# EAGLE design pc_kalam_gpio_cap (EAGLE 6.4)
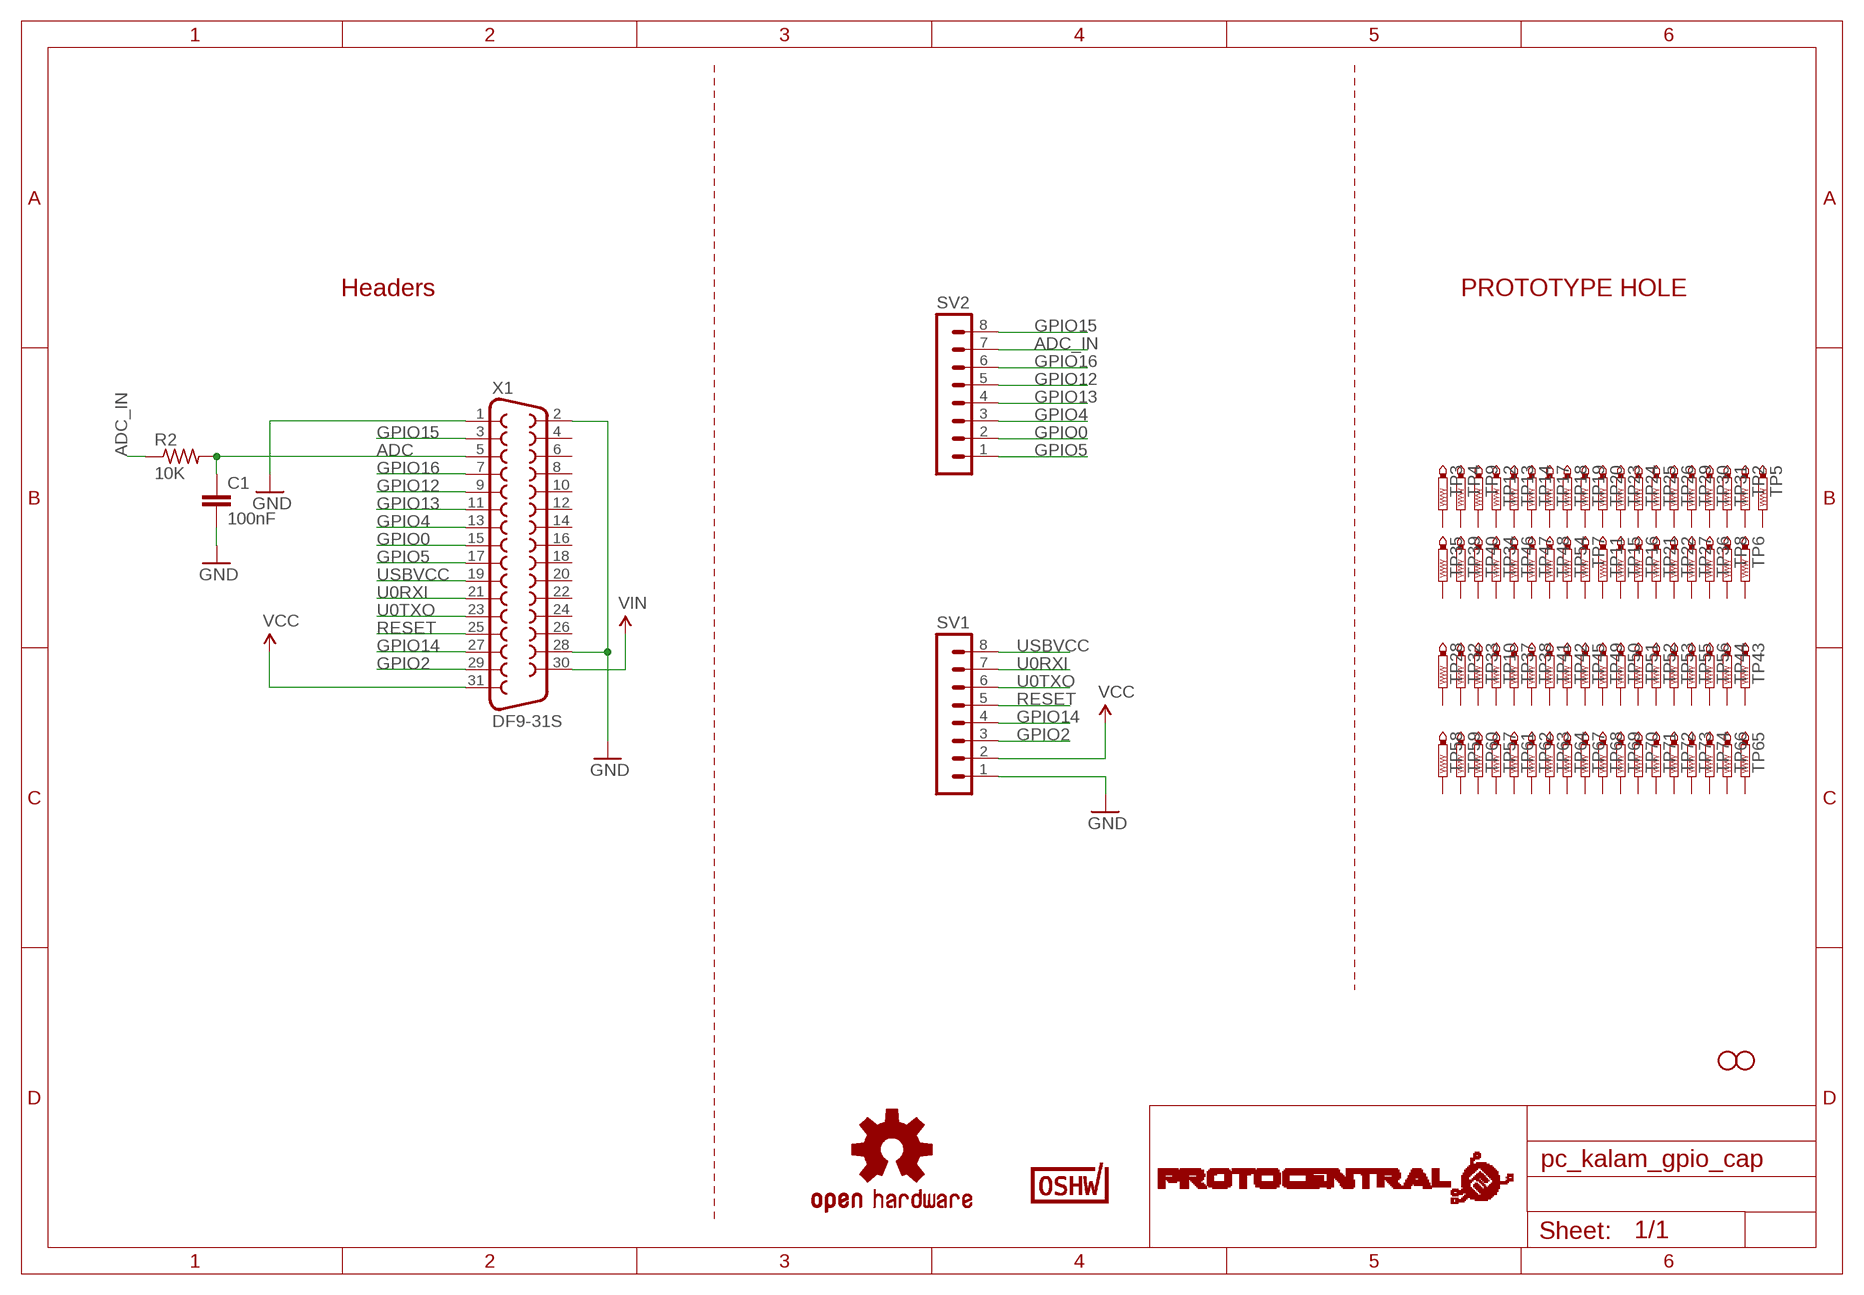
[diagram p0: schematic, sheet 1]

## Parts
C1  100nF  C-EUC0805  [C0805]
R2  10K  R-US_R0805  [R0805]
STANDOFF7  STAND-OFF  [STAND-OFF]
STANDOFF8  STAND-OFF  [STAND-OFF]
SV1  MA08-1  [MA08-1]
SV2  MA08-1  [MA08-1]
TP2  PTR1PAD1-13  [P1-13]
TP3  PTR1PAD1-13  [P1-13]
TP4  PTR1PAD1-13  [P1-13]
TP5  PTR1PAD1-13  [P1-13]
TP6  PTR1PAD1-13  [P1-13]
TP7  PTR1PAD1-13  [P1-13]
TP8  PTR1PAD1-13  [P1-13]
TP9  PTR1PAD1-13  [P1-13]
TP10  PTR1PAD1-13  [P1-13]
TP11  PTR1PAD1-13  [P1-13]
TP12  PTR1PAD1-13  [P1-13]
TP13  PTR1PAD1-13  [P1-13]
TP14  PTR1PAD1-13  [P1-13]
TP15  PTR1PAD1-13  [P1-13]
TP16  PTR1PAD1-13  [P1-13]
TP17  PTR1PAD1-13  [P1-13]
TP18  PTR1PAD1-13  [P1-13]
TP19  PTR1PAD1-13  [P1-13]
TP20  PTR1PAD1-13  [P1-13]
TP21  PTR1PAD1-13  [P1-13]
TP22  PTR1PAD1-13  [P1-13]
TP23  PTR1PAD1-13  [P1-13]
TP24  PTR1PAD1-13  [P1-13]
TP25  PTR1PAD1-13  [P1-13]
TP26  PTR1PAD1-13  [P1-13]
TP27  PTR1PAD1-13  [P1-13]
TP28  PTR1PAD1-13  [P1-13]
TP29  PTR1PAD1-13  [P1-13]
TP30  PTR1PAD1-13  [P1-13]
TP31  PTR1PAD1-13  [P1-13]
TP32  PTR1PAD1-13  [P1-13]
TP33  PTR1PAD1-13  [P1-13]
TP34  PTR1PAD1-13  [P1-13]
TP35  PTR1PAD1-13  [P1-13]
TP36  PTR1PAD1-13  [P1-13]
TP37  PTR1PAD1-13  [P1-13]
TP38  PTR1PAD1-13  [P1-13]
TP39  PTR1PAD1-13  [P1-13]
TP40  PTR1PAD1-13  [P1-13]
TP41  PTR1PAD1-13  [P1-13]
TP42  PTR1PAD1-13  [P1-13]
TP43  PTR1PAD1-13  [P1-13]
TP44  PTR1PAD1-13  [P1-13]
TP45  PTR1PAD1-13  [P1-13]
TP46  PTR1PAD1-13  [P1-13]
TP47  PTR1PAD1-13  [P1-13]
TP48  PTR1PAD1-13  [P1-13]
TP49  PTR1PAD1-13  [P1-13]
TP50  PTR1PAD1-13  [P1-13]
TP51  PTR1PAD1-13  [P1-13]
TP52  PTR1PAD1-13  [P1-13]
TP53  PTR1PAD1-13  [P1-13]
TP54  PTR1PAD1-13  [P1-13]
TP55  PTR1PAD1-13  [P1-13]
TP56  PTR1PAD1-13  [P1-13]
TP57  PTR1PAD1-13  [P1-13]
TP58  PTR1PAD1-13  [P1-13]
TP59  PTR1PAD1-13  [P1-13]
TP60  PTR1PAD1-13  [P1-13]
TP61  PTR1PAD1-13  [P1-13]
TP62  PTR1PAD1-13  [P1-13]
TP63  PTR1PAD1-13  [P1-13]
TP64  PTR1PAD1-13  [P1-13]
TP65  PTR1PAD1-13  [P1-13]
TP66  PTR1PAD1-13  [P1-13]
TP67  PTR1PAD1-13  [P1-13]
TP68  PTR1PAD1-13  [P1-13]
TP69  PTR1PAD1-13  [P1-13]
TP70  PTR1PAD1-13  [P1-13]
TP71  PTR1PAD1-13  [P1-13]
TP72  PTR1PAD1-13  [P1-13]
TP73  PTR1PAD1-13  [P1-13]
TP74  PTR1PAD1-13  [P1-13]
U$2  CERT-SMALL  [CERT-SMALL-SILK]
U$3  OSHW-LOGOS  [OSHW-LOGO-S]
U$6  PROTY_LOGO_WITH_TEXT  [PROTY_WITH_TEXT]
X1  DF9-31S  [DF9-31S]

## Nets
ADC: C1.1 R2.2 X1.5
ADC_IN: R2.1 SV2.7
GND: C1.2 SV1.1 X1.1 X1.2 X1.28
GPIO0: SV2.2 X1.15
GPIO2: SV1.3 X1.29
GPIO4: SV2.3 X1.13
GPIO5: SV2.1 X1.17
GPIO12: SV2.5 X1.9
GPIO13: SV2.4 X1.11
GPIO14: SV1.4 X1.27
GPIO15: SV2.8 X1.3
GPIO16: SV2.6 X1.7
RESET: SV1.5 X1.25
U0RXI: SV1.7 X1.21
U0TXO: SV1.6 X1.23
USBVCC: SV1.8 X1.19
VCC: SV1.2 X1.31
VIN: X1.30
Unconnected: TP2.TP TP3.TP TP4.TP TP5.TP TP6.TP TP7.TP TP8.TP TP9.TP TP10.TP TP11.TP TP12.TP TP13.TP TP14.TP TP15.TP TP16.TP TP17.TP TP18.TP TP19.TP TP20.TP TP21.TP TP22.TP TP23.TP TP24.TP TP25.TP TP26.TP TP27.TP TP28.TP TP29.TP TP30.TP TP31.TP TP32.TP TP33.TP TP34.TP TP35.TP TP36.TP TP37.TP TP38.TP TP39.TP TP40.TP TP41.TP TP42.TP TP43.TP TP44.TP TP45.TP TP46.TP TP47.TP TP48.TP TP49.TP TP50.TP TP51.TP TP52.TP TP53.TP TP54.TP TP55.TP TP56.TP TP57.TP TP58.TP TP59.TP TP60.TP TP61.TP TP62.TP TP63.TP TP64.TP TP65.TP TP66.TP TP67.TP TP68.TP TP69.TP TP70.TP TP71.TP TP72.TP TP73.TP TP74.TP X1.4 X1.6 X1.8 X1.10 X1.12 X1.14 X1.16 X1.18 X1.20 X1.22 X1.24 X1.26

## Notes on the sheet
- Headers | PROTOTYPE HOLE

## Library data of the parts
C1 = rcl:C-EU: CAPACITOR, European symbol
R2 = rcl:R-US_: RESISTOR, American symbol
STANDOFF7 STANDOFF8 = SparkFun-Electromechanical:STAND-OFF: #4 Stand Off This is the mechanical footprint for a #4 phillips button head screw. Use the keepout ring to avoid running the screw head into surrounding components. SKU : PRT-00447
SV1 SV2 = con-lstb:MA08-1: PIN HEADER; OC_FARNELL: unknown; OC_NEWARK: unknown
TP2-TP74 = testpad:PTR1: TEST PIN
U$2 = OSHWA:CERT
U$3 = SparkFun:OSHW-LOGO: Open Source Hardware Logo This logo indicates the piece of hardware it is found on incorporates a OSHW license and/or adheres to the definition of open source hardware found here: http://freedomdefined.org/OSHW
U$6 = circuitects:PROTY_LOGO_WITH_TEXT
X1 = con-hirose:DF9-31S: SMD CONNECTOR Source: con-hirose.lbr from Bob Starr <rtzaudio@mindspring.com>; MPN: DF9-31S-1V(32); OC_FARNELL: 1798382; OC_NEWARK: 74R3383

## Board
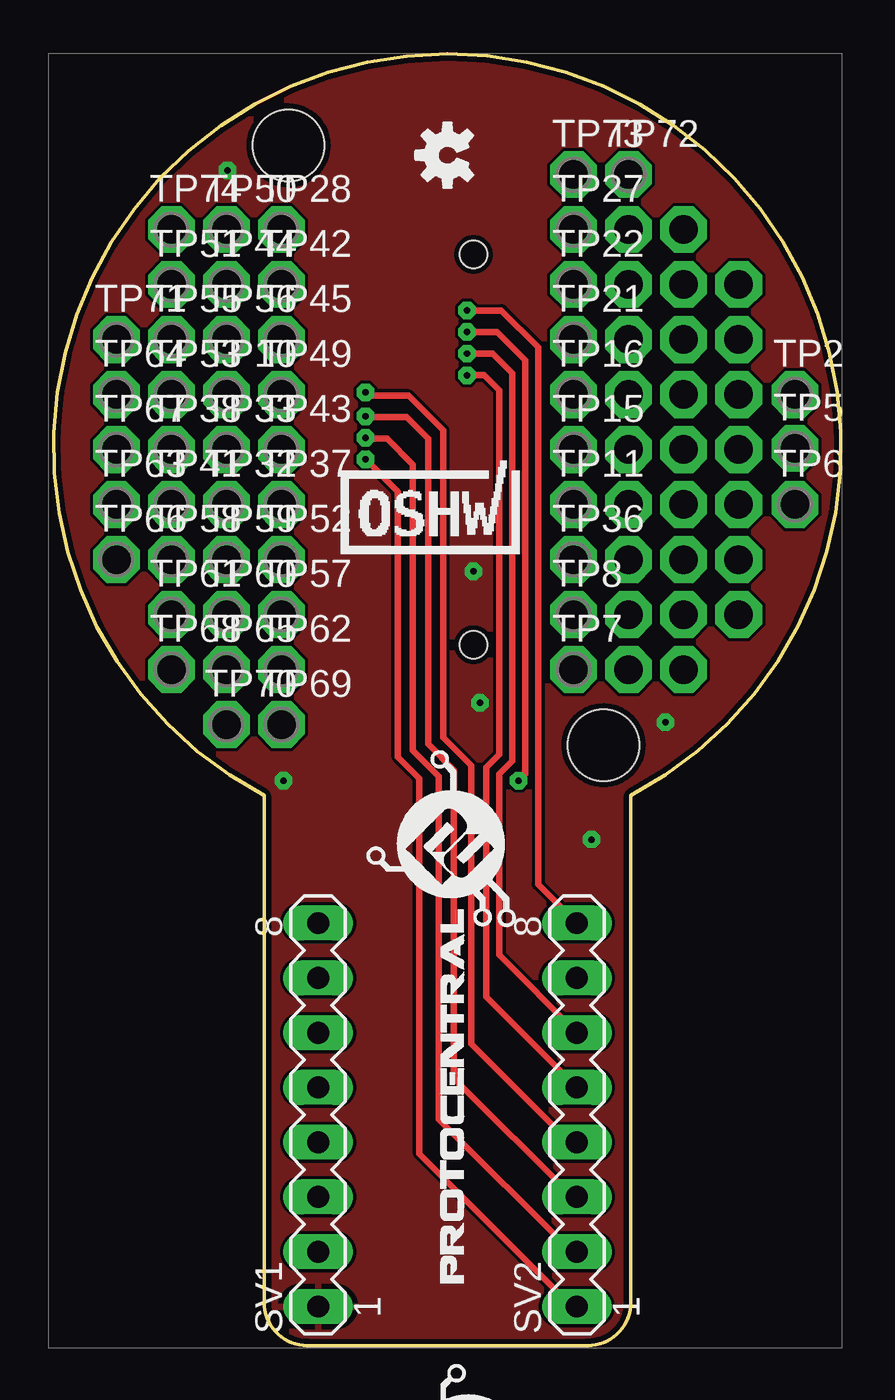
[diagram p1: board, top side]
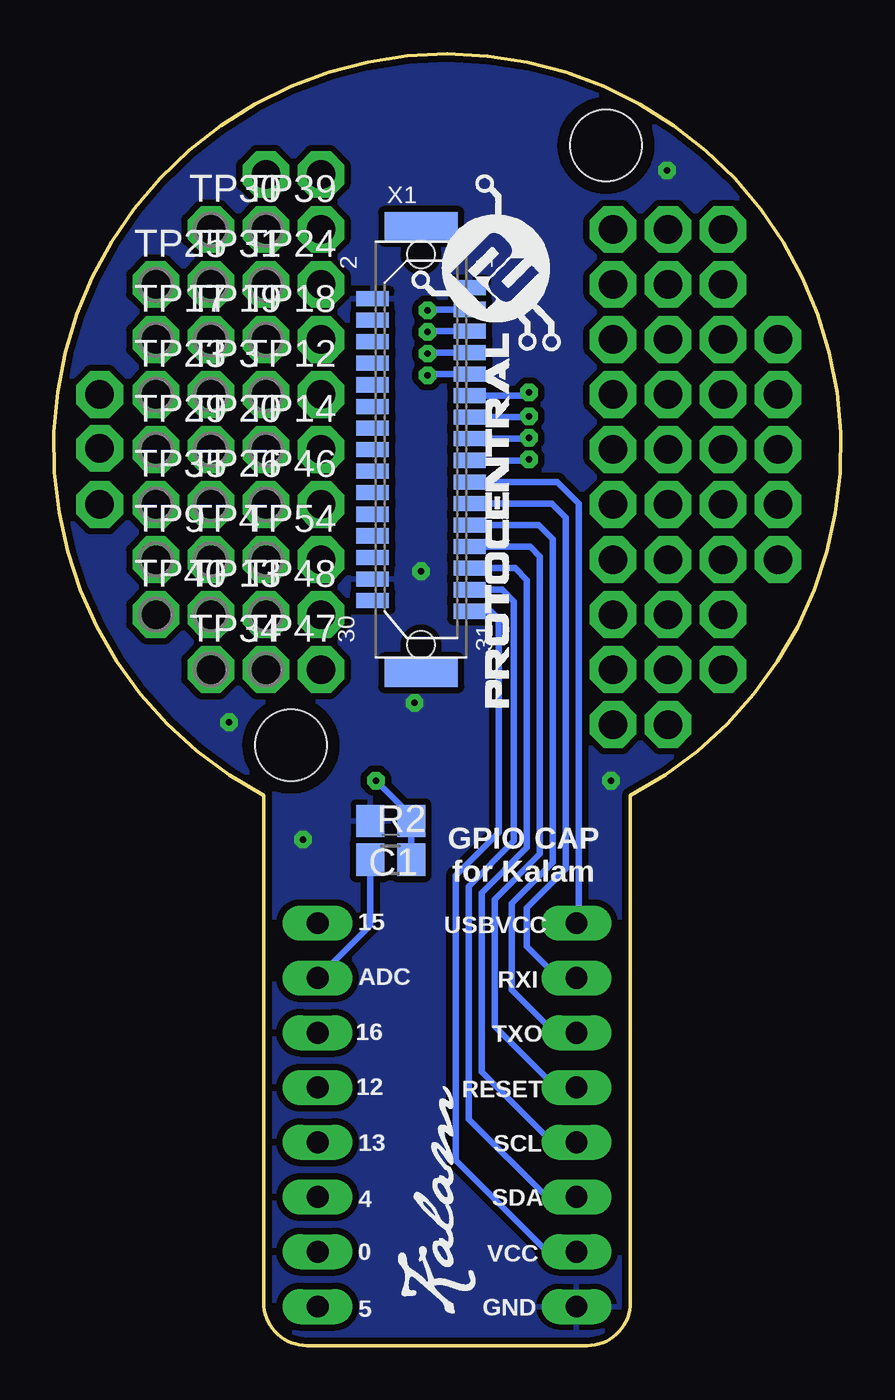
[diagram p2: board, bottom side, seen from below]

Size 36.47 x 59.9 mm. Coordinates in mm from the lower left corner, seen from the top.
Outline: 26.74,25.5 26.74,2 arc-90 24.74,0 11.74,0 arc-90 9.74,2 9.74,25.5 arc-304 26.74,25.51
Copper layers (1*2*15*16): Top 0.035mm / dielectric 1.5mm / Route2 0.035mm / dielectric 0.15mm / Route15 0.035mm / dielectric 0.2mm / Bottom 0.035mm
Design rules "Circuitects-Rules": minimum track width 6mil, minimum drill 0.3mm, track to track 6mil, track to pad 6mil, pad to pad 6mil, via to via 6mil, smd to smd 6mil, copper to edge 10mil, drill to drill 8mil, minimum pad ring 12mil, minimum via ring 10mil, stop-mask expansion 4mil, vias tented up to drill 25mil, thermal gap 10mil

### Footprints (pad centres in the part's own frame; a part is rotated, then mirrored left to right if it is on the bottom)
C0805 = smd 1.3 x 1.5: 1 -0.95,0; 2 0.95,0
R0805 = smd 1.3 x 1.5: 1 -0.95,0; 2 0.95,0
STAND-OFF = hole 3.302: 0,0
MA08-1 = drill 1.016 long: 1 -8.89,0; 2 -6.35,0; 3 -3.81,0; 4 -1.27,0; 5 1.27,0; 6 3.81,0; 7 6.35,0; 8 8.89,0
P1-13 = drill 1.321 pad 2.159 octagon: TP 0,0
DF9-31S = smd 0.7 x 1.5: 1 -7.5,2.25; 2 -7,-2.25; 3 -6.5,2.25; 4 -6,-2.25; 5 -5.5,2.25; 6 -5,-2.25; 7 -4.5,2.25; 8 -4,-2.25; 9 -3.5,2.25; 10 -3,-2.25; 11 -2.5,2.25; 12 -2,-2.25; 13 -1.5,2.25; 14 -1,-2.25; 15 -0.5,2.25; 16 0,-2.25; 17 0.5,2.25; 18 1,-2.25; 19 1.5,2.25; 20 2,-2.25; 21 2.5,2.25; 22 3,-2.25; 23 3.5,2.25; 24 4,-2.25; 25 4.5,2.25; 26 5,-2.25; 27 5.5,2.25; 28 6,-2.25; 29 6.5,2.25; 30 7,-2.25; 31 7.5,2.25 | smd 1.3 x 3.4: M1 -10.35,0; M2 10.35,0 | hole 1.27: 9.05,0; -9.05,0

### Placement (x,y rotation side)
C1  20.86,24.33 180 bottom
R2  20.86,22.53 0 bottom
STANDOFF7  10.88,55.66 0 bottom
STANDOFF8  25.48,27.84 0 bottom
SV1  12.24,10.7 90 top
SV2  24.24,10.7 90 top
TP2  34.34,44.1 0 top
TP3  29.19,44.1 0 bottom
TP4  29.19,36.45 0 bottom
TP5  34.34,41.6 0 top
TP6  34.34,39 0 top
TP7  24.09,31.35 0 top
TP8  24.09,33.9 0 top
TP9  31.74,36.45 0 bottom
TP10  7.99,44.1 0 top
TP11  24.09,39 0 top
TP12  26.64,44.1 0 bottom
TP13  29.19,33.9 0 bottom
TP14  26.64,41.55 0 bottom
TP15  24.09,41.55 0 top
TP16  24.09,44.1 0 top
TP17  31.74,46.65 0 bottom
TP18  26.64,46.65 0 bottom
TP19  29.19,46.65 0 bottom
TP20  29.19,41.55 0 bottom
TP21  24.09,46.65 0 top
TP22  24.09,49.2 0 top
TP23  31.74,44.1 0 bottom
TP24  26.64,49.2 0 bottom
TP25  31.74,49.2 0 bottom
TP26  29.19,39 0 bottom
TP27  24.09,51.75 0 top
TP28  10.54,51.75 0 top
TP29  31.74,41.55 0 bottom
TP30  29.19,51.75 0 bottom
TP31  29.19,49.2 0 bottom
TP32  7.99,39 0 top
TP33  7.99,41.55 0 top
TP34  29.19,31.35 0 bottom
TP35  31.74,39 0 bottom
TP36  24.09,36.45 0 top
TP37  10.54,39 0 top
TP38  5.44,41.55 0 top
TP39  26.64,51.75 0 bottom
TP40  31.74,33.9 0 bottom
TP41  5.44,39 0 top
TP42  10.54,49.2 0 top
TP43  10.54,41.55 0 top
TP44  7.99,49.2 0 top
TP45  10.54,46.65 0 top
TP46  26.64,39 0 bottom
TP47  26.64,31.35 0 bottom
TP48  26.64,33.9 0 bottom
TP49  10.54,44.1 0 top
TP50  7.99,51.75 0 top
TP51  5.44,49.2 0 top
TP52  10.54,36.45 0 top
TP53  5.44,44.1 0 top
TP54  26.64,36.45 0 bottom
TP55  5.44,46.65 0 top
TP56  7.99,46.65 0 top
TP57  10.54,33.9 0 top
TP58  5.44,36.45 0 top
TP59  7.99,36.45 0 top
TP60  7.99,33.9 0 top
TP61  5.44,33.9 0 top
TP62  10.54,31.35 0 top
TP63  2.89,39 0 top
TP64  2.89,44.1 0 top
TP65  7.99,31.35 0 top
TP66  2.89,36.45 0 top
TP67  2.89,41.55 0 top
TP68  5.44,31.35 0 top
TP69  10.54,28.8 0 top
TP70  7.99,28.8 0 top
TP71  2.89,46.65 0 top
TP72  26.64,54.3 0 top
TP73  24.09,54.3 0 top
TP74  5.44,51.75 0 top
U$1  PROTY_LOGO_WITH_TEXT  [PROTY_WITH_TEXT]  13.34,29.6 90 bottom
U$2  17.44,36.7 0 top
U$3  18.24,55.2 90 top
U$4  [KALAM-NAME-ONLY]  16.94,1.4 90 bottom
U$5  PROTY_LOGO_WITH_TEXT  [PROTY_WITH_TEXT]  21.04,2.9 90 top
U$6  -1.16,-7.4 0 top  (outside the outline)
X1  19.44,41.55 270 bottom

### Tracks (layer width: path | path; a pad name or v marks a point on that pad's centre or on a via)
ADC  (via drill 0.3)
  Top 0.305: v19.14,47 20.54,47 21.84,45.7 21.84,26.5 v21.54,26.2
  Bottom 0.305: R2.2 C1.1 19.91,24.57 v21.54,26.2 | X1.5 19.09,47.05 v19.14,47
ADC_IN
  Bottom 0.305: R2.1 21.81,19.48 SV2.7
GND  (via drill 0.3)
  other vias: 28.34,28.9 8.04,54.5 19.74,29.8 24.92,23.47 10.64,26.2 19.44,35.9
  pour Bottom (isolate 0.305, rank 6): -0.86,-0.45 -0.66,32.55 -0.96,40 -1.06,60.8 37.24,60.3 37.54,39.95 37.07,28.05 37.57,4.35 37.54,-0.55 32.94,-0.7
  pour Top: -0.96,60.5 37.84,60.2 37.14,-0.7 -0.66,-0.7
GPIO0  (via drill 0.3)
  Top 0.305: SV2.2 23.99,4.35 17.84,10.5 17.84,26.4 16.64,27.6 16.64,40.85 15.44,42.05 14.49,42.05 v14.44,42.1
  Bottom 0.305: X1.15 14.49,42.05 v14.44,42.1
GPIO2
  Bottom 0.305: X1.29 15.69,35.05 15.14,34.5 15.14,23.4 17.24,21.3 17.24,10.5 13.63,6.89 SV1.3
GPIO4  (via drill 0.3)
  Top 0.305: SV2.3 24.05,6.89 18.54,12.4 18.54,26.7 17.34,27.9 17.34,42.05 16.34,43.05 14.49,43.05 v14.44,43.1
  Bottom 0.305: X1.13 14.49,43.05 v14.44,43.1
GPIO5  (via drill 0.3)
  Top 0.305: SV2.1 24.03,1.81 16.94,8.9 16.94,26.3 15.94,27.3 15.94,39.6 v14.44,41.1
  Bottom 0.305: X1.17 14.49,41.05 v14.44,41.1
GPIO12  (via drill 0.3)
  Top 0.305: v19.14,45 19.94,45 20.64,44.3 20.64,27.4 20.04,26.8 20.04,16.17 SV2.5
  Bottom 0.305: X1.9 19.09,45.05 v19.14,45
GPIO13  (via drill 0.3)
  Top 0.305: SV2.4 23.91,9.43 19.34,14 19.34,26.9 18.04,28.2 18.04,42.45 16.44,44.05 14.59,44.05 v14.44,44.2
  Bottom 0.305: X1.11 14.59,44.05 v14.44,44.2
GPIO14
  Bottom 0.305: X1.27 15.09,36.05 14.54,35.5 14.54,23.1 16.64,21 16.64,12.7 13.37,9.43 SV1.4
GPIO15  (via drill 0.3)
  Top 0.305: v19.14,48 20.74,48 22.44,46.3 22.44,21.39 SV2.8
  Bottom 0.305: X1.3 19.09,48.05 v19.14,48
GPIO16  (via drill 0.3)
  Top 0.305: v19.14,46 20.34,46 21.24,45.1 21.24,27.1 20.64,26.5 20.64,18.11 SV2.6
  Bottom 0.305: X1.7 19.09,46.05 v19.14,46
RESET
  Bottom 0.305: X1.25 14.39,37.05 13.94,36.6 13.94,22.8 16.04,20.7 16.04,14.8 13.21,11.97 SV1.5
U0RXI
  Bottom 0.305: X1.21 13.39,39.05 12.74,38.4 12.74,22.1 14.54,20.3 14.54,18.5 13.09,17.05 SV1.7
U0TXO
  Bottom 0.305: X1.23 13.99,38.05 13.34,37.4 13.34,22.4 15.24,20.5 15.24,16.5 13.25,14.51 SV1.6
USBVCC
  Bottom 0.305: X1.19 13.14,40.05 12.13,39.04 12.13,19.7 SV1.8
VCC
  Bottom 0.305: X1.31 16.19,34.05 15.84,33.7 15.84,23.8 17.84,21.8 17.84,8.6 13.59,4.35 SV1.2

### Text on the board
bPlace: GPIO CAP / for Kalam | USBVCC | 15 | RXI | ADC | 16 | TXO | RESET | 12 | SCL | 13 | SDA | 4 | VCC | 0 | GND | 5